# EAGLE design wall_power (EAGLE 6.4)
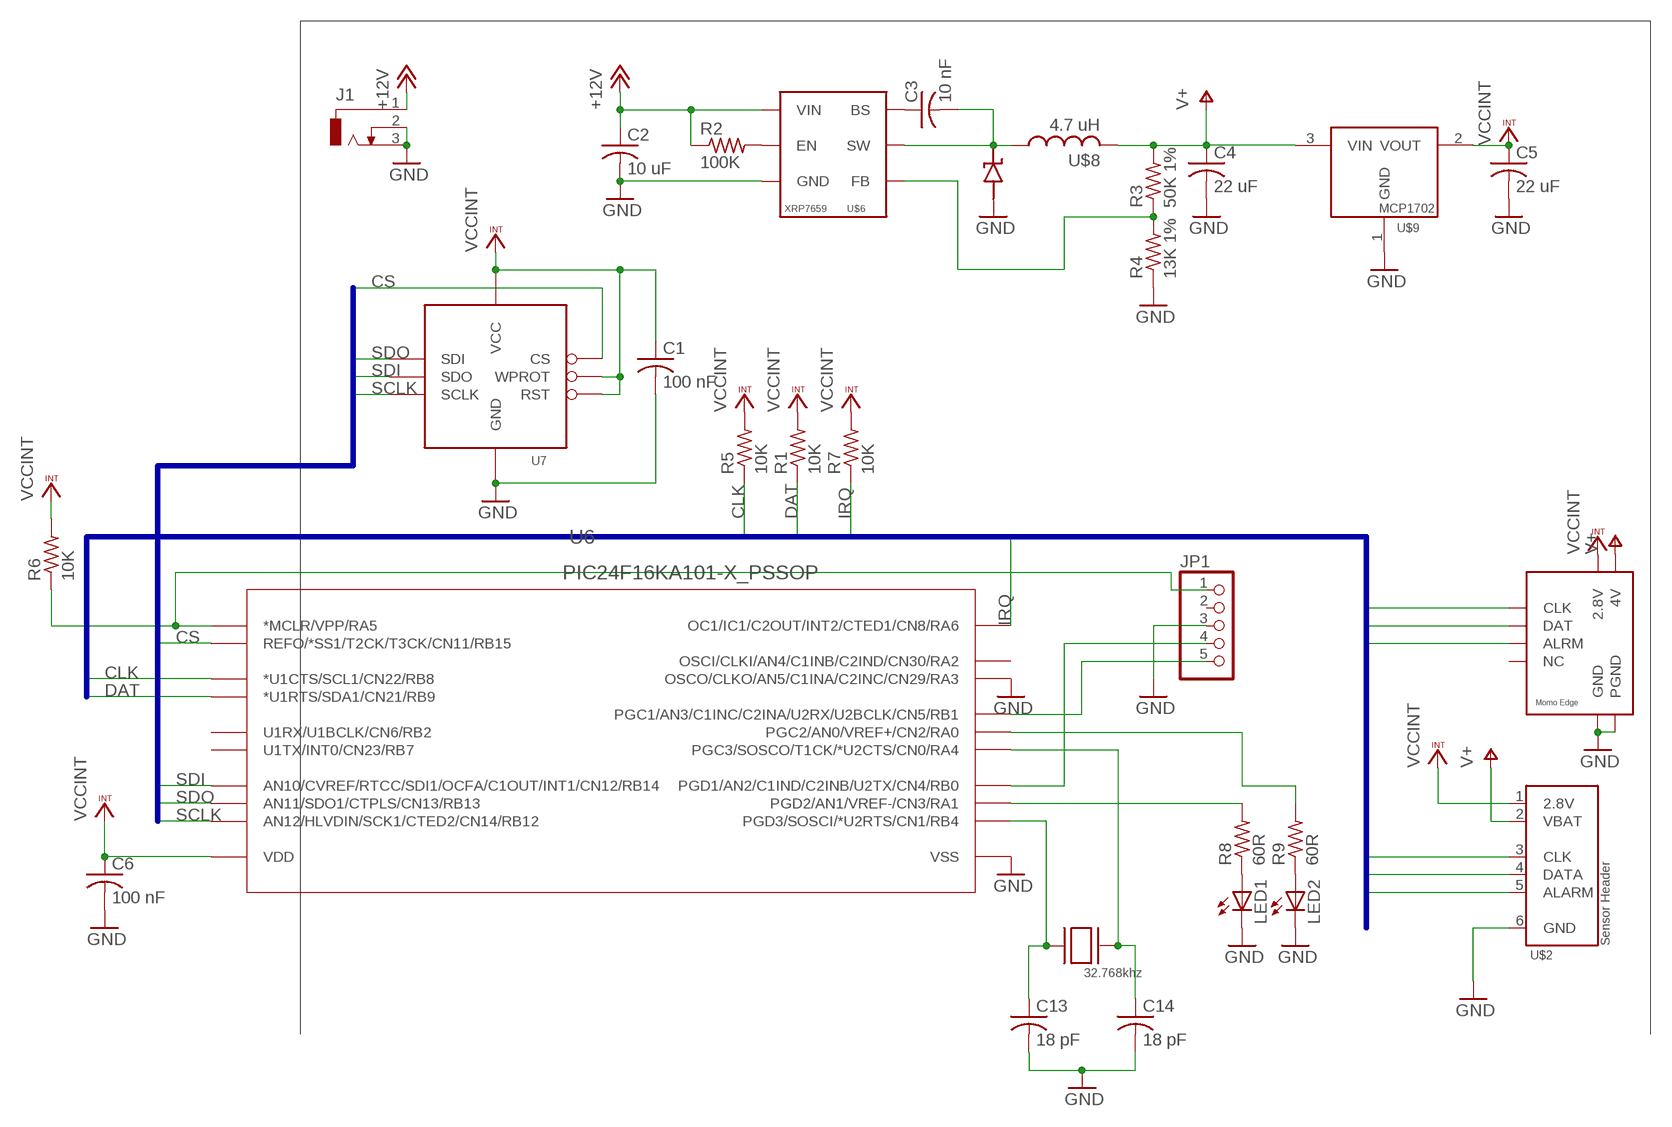
[diagram p0: schematic, sheet 1]

## Parts
C1  100 nF  C-USC0402  [C0402]
C2  10 uF  C-USC0805  [C0805]
C3  10 nF  C-USC0402  [C0402]
C4  22 uF  C-USC1206  [C1206]
C5  22 uF  C-USC0402  [C0402]
C6  100 nF  C-USC0402  [C0402]
C13  18 pF  C-USC0402K  [C0402K]
C14  18 pF  C-USC0402K  [C0402K]
J1  DCJ0303  [DCJ0303]
JP1  PINHD-1X5  [1X05]
LED1  LEDSML0603  [SML0603]
LED2  LEDSML0603  [SML0603]
R1  10K  R-US_R0603  [R0603]
R2  100K  R-US_R0603  [R0603]
R3  50K 1%  R-US_R0603  [R0603]
R4  13K 1%  R-US_R0603  [R0603]
R5  10K  R-US_R0603  [R0603]
R6  10K  R-US_R0603  [R0603]
R7  10K  R-US_R0603  [R0603]
R8  60R  R-US_R0603  [R0603]
R9  60R  R-US_R0603  [R0603]
U6  PIC24F16KA101-X_PSSOP  [SSOP20]
U7  FLASH8MSOP8  [SOP08]
U$1  MOMO-EDGE-8F  [MOMO-EDGE-8F]
U$2  MOMO-SENSOR-HEADER  [2X3-MOLEX-90130@1]
U$6  XRP7659  [SOT23-6L]
U$7  DIODE_SS2P3  [DIODE_SS2P3]
U$8  4.7 uH  NR6028-INDUCTOR  [NR6028-INDUCTOR]
U$9  MCP1702  [SOT23]
XTAL1  32.768khz  SMD-XTAL  [1206]

## Nets
+12V: C2.1 J1.1 R2.1 U$6.5(VIN)
CLK: R5.1 U6.12(*U1CTS/SCL1/CN22/RB8) U$1.CLK U$2.3(CLK)
CS: U6.18(REFO/*SS1/T2CK/T3CK/CN11/RB15) U7.1(CS)
DAT: R1.1 U6.13(*U1RTS/SDA1/CN21/RB9) U$1.DAT U$2.4(DATA)
GND: C1.2 C2.2 C4.2 C5.2 C6.2 C13.2 C14.2 J1.2 J1.3 JP1.3 LED1.C LED2.C R4.1 U6.8(OSCO/CLKO/AN5/C1INA/C2INC/CN29/RA3) U6.19(VSS) U7.4(GND) U$1.GND U$1.PGND U$2.6(GND) U$6.2(GND) U$7.AN U$9.1(GND)
IRQ: R7.1 U6.14(OC1/IC1/C2OUT/INT2/CTED1/CN8/RA6) U$1.ARLM(ALRM) U$2.5(ALARM)
N$1: R9.2 U6.2(PGC2/AN0/VREF+/CN2/RA0)
N$2: C3.2 U$6.6(SW) U$7.CATH U$8.1
N$3: R2.2 U$6.4(EN)
N$4: C3.1 U$6.1(BS)
N$5: LED2.A R9.1
N$6: R3.1 R4.2 U$6.3(FB)
N$7: LED1.A R8.1
N$8: R8.2 U6.3(PGD2/AN1/VREF-/CN3/RA1)
N$9: JP1.4 U6.4(PGD1/AN2/C1IND/C2INB/U2TX/CN4/RB0)
N$10: JP1.5 U6.5(PGC1/AN3/C1INC/C2INA/U2RX/U2BCLK/CN5/RB1)
N$15: JP1.1 R6.1 U6.1(*MCLR/VPP/RA5)
N$24: C14.1 U6.10(PGC3/SOSCO/T1CK/*U2CTS/CN0/RA4) XTAL1.P$2(XTAL2)
N$25: C13.1 U6.9(PGD3/SOSCI/*U2RTS/CN1/RB4) XTAL1.P$1(XTAL1)
SCLK: U6.15(AN12/HLVDIN/SCK1/CTED2/CN14/RB12) U7.6(SCLK)
SDI: U6.17(AN10/CVREF/RTCC/SDI1/OCFA/C1OUT/INT1/CN12/RB14) U7.2(SDO)
SDO: U6.16(AN11/SDO1/CTPLS/CN13/RB13) U7.5(SDI)
V+: C4.1 R3.2 U$1.V4.(4V) U$2.2(VBAT) U$8.2 U$9.3(VIN)
VCCINT: C1.1 C5.1 C6.1 R1.2 R5.2 R6.2 R7.2 U6.20(VDD) U7.3(WPROT) U7.7(RST) U7.8(VCC) U$1.V28(2.8V) U$2.1(2.8V) U$9.2(VOUT)
Unconnected: JP1.2 U6.6(U1RX/U1BCLK/CN6/RB2) U6.7(OSCI/CLKI/AN4/C1INB/C2IND/CN30/RA2) U6.11(U1TX/INT0/CN23/RB7) U$1.NV(NC)

## Buses
PICBUS:CLK,DAT,IRQ
SPI:CS,SDI,SDO,SCLK

## Library data of the parts
C1-C6 C13 C14 = rcl:C-US: CAPACITOR, American symbol
J1 = con-jack:DCJ0303: DC POWER JACK Source: DCJ0303.pdf; OC_FARNELL: unknown; OC_NEWARK: unknown
JP1 = pinhead:PINHD-1X5: PIN HEADER
LED1 LED2 = led:LED: LED OSRAM: - CHIPLED LG R971, LG N971, LY N971, LG Q971, LY Q971, LO R971, LY R971 LH N974, LH R974 LS Q976, LO Q976, LY Q976 LO Q996 - Hyper CHIPLED LW Q18S LB Q993, LB Q99A, LB R99A - SideLED LS A670, LO A670, LY A670, LG A670, LP A670 LB A673, LV A673, LT A673, LW A673 LH A674 LY A675 LS A676, LA A676, LO A676, LY A676, LW A676 LS A679, LY A679, LG A679 - Hyper Micro SIDELED® LS Y876, LA Y876, LO Y876, LY Y876 LT Y87S - SmartLED LW L88C, LW L88S LB L89C, LB L89S, LG L890 LS L89K, LO L89K, LY L89K LS L896, LA L896, LO L896, LY L896 - TOPLED LS T670, LO T670, LY T670, LG T670, LP T670 LSG T670, LSP T670, LSY T670, LOP T670, LYG T670 LG T671, LOG T671, LSG T671 LB T673, LV T673, LT T673, LW T673 LH T674 LS T676, LA T676, LO T676, LY T676, LB T676, LH T676, LSB T676, LW T676 LB T67C, LV T67C, LT T67C, LS T67K, LO T67K, LY T67K, LW E67C LS E67B, LA E67B, LO E67B, LY E67B, LB E67C, LV E67C, LT E67C LW T67C LS T679, LY T679, LG T679 LS T770, LO T770, LY T770, LG T770, LP T770 LB T773, LV T773, LT T773, LW T773 LH T774 LS E675, LA E675, LY E675, LS T675 LS T776, LA T776, LO T776, LY T776, LB T776 LHGB T686 LT T68C, LB T68C - Hyper Mini TOPLED® LB M676 - Mini TOPLED Santana® LG M470 LS M47K, LO M47K, LY M47K Source: http://www.osram.convergy.de LUXEON: - LUMILED® LXK2-PW12-R00, LXK2-PW12-S00, LXK2-PW14-U00, LXK2-PW14-V00 LXK2-PM12-R00, LXK2-PM12-S00, LXK2-PM14-U00 LXK2-PE12-Q00, LXK2-PE12-R00, LXK2-PE12-S00, LXK2-PE14-T00, LXK2-PE14-U00 LXK2-PB12-K00, LXK2-PB12-L00, LXK2-PB12-M00, LXK2-PB14-N00, LXK2-PB14-P00, LXK2-PB14-Q00 LXK2-PR12-L00, LXK2-PR12-M00, LXK2-PR14-Q00, LXK2-PR14-R00 LXK2-PD12-Q00, LXK2-PD12-R00, LXK2-PD12-S00 LXK2-PH12-R00, LXK2-PH12-S00 LXK2-PL12-P00, LXK2-PL12-Q00, LXK2-PL12-R00 Source: www.luxeon.com KINGBRIGHT: KA-3528ASYC Source: www.kingbright.com
R1-R9 = rcl:R-US_: RESISTOR, American symbol
U6 = components:PIC24F16KA101-X_P
U7 = components:FLASH8M
U$1 = components:MOMO-EDGE-8F
U$2 = components:MOMO-SENSOR-HEADER
U$6 = components:XRP7659
U$7 = components:DIODE_SS2P3
U$8 = components:NR6028-INDUCTOR
U$9 = components:MCP1702
XTAL1 = components:SMD-XTAL

## Net classes
0 default: width 0.152 mm, drill 0.305 mm, clearance 0.152 mm

## Board
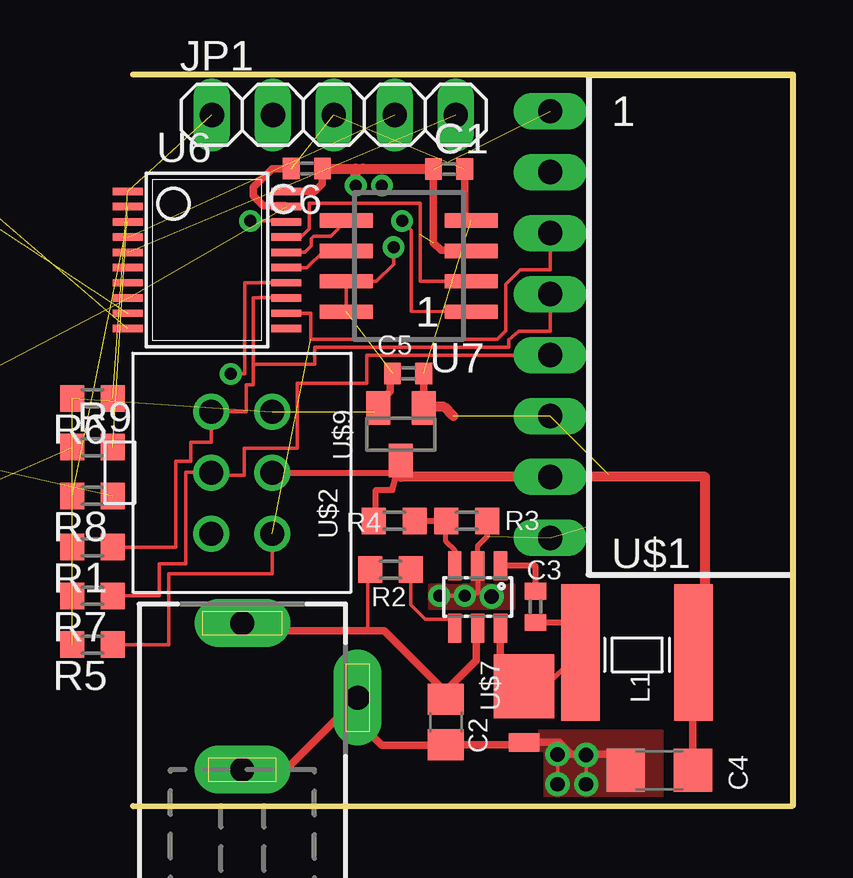
[diagram p1: board, top side]
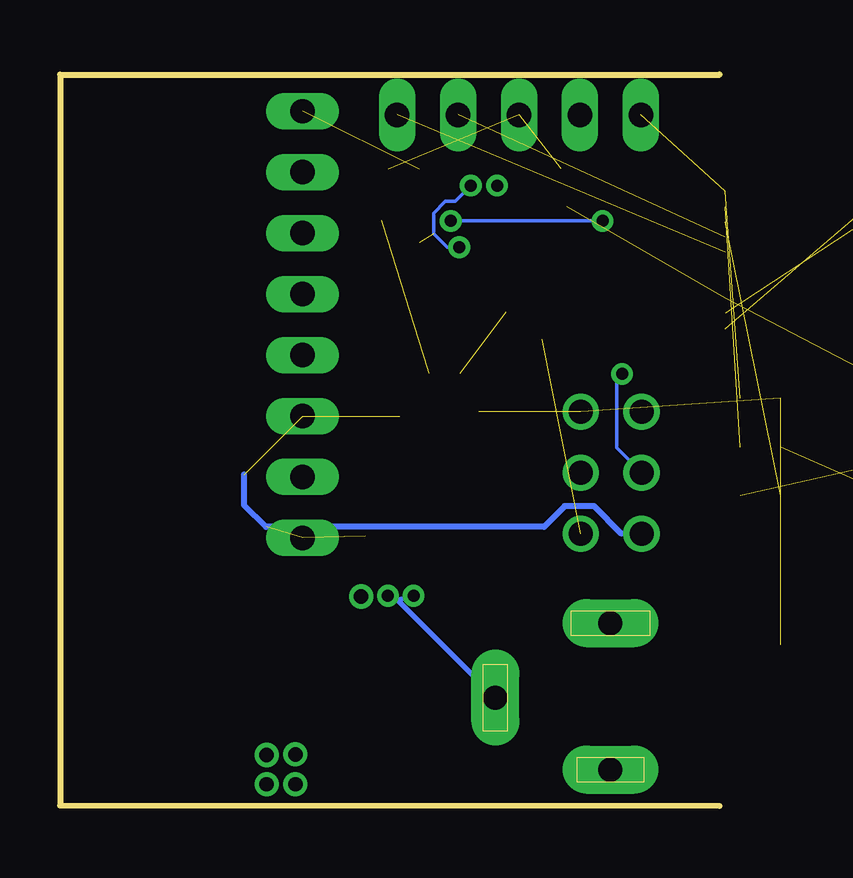
[diagram p2: board, bottom side, seen from below]

Size 27.48 x 30.48 mm. Coordinates in mm from the lower left corner, seen from the top.
Outline: 0,0 27.48,0.03 27.48,30.48 0,30.48
Copper layers (1*16): Top 0.035mm / dielectric 1.5mm / Bottom 0.035mm
Design rules "default *": minimum track width 6mil, minimum drill 19mil, track to track 6mil, track to pad 6mil, pad to pad 6mil, via to via 6mil, smd to smd 6mil, copper to edge 10mil, drill to drill 8mil, minimum pad ring 10mil, minimum via ring 8mil, stop-mask expansion 4mil, vias tented up to drill 0mil, thermal gap 10mil

### Footprints (pad centres in the part's own frame; a part is rotated, then mirrored left to right if it is on the bottom)
C0402 = smd 0.7 x 0.9: 1 -0.65,0; 2 0.65,0
C0805 = smd 1.3 x 1.5: 1 -0.95,0; 2 0.95,0
C1206 = smd 1.6 x 1.8: 1 -1.4,0; 2 1.4,0
C0402K = smd 0.925 x 0.74: 1 -0.6,0; 2 0.6,0
DCJ0303 = drill 1 pad 2 long: 1 0,3.1; 2 4.8,0; 3 0,-3
1X05 = drill 1.016 long: 1 -5.08,0; 2 -2.54,0; 3 0,0; 4 2.54,0; 5 5.08,0
SML0603 = smd 0.8 x 0.8: A 0.75,0; C -0.75,0
R0603 = smd 1 x 1.1: 1 -0.85,0; 2 0.85,0
SSOP20 = smd 0.305 x 1.245: 1 -2.857,-3.302; 2 -2.222,-3.302; 3 -1.587,-3.302; 4 -0.952,-3.302; 5 -0.317,-3.302; 6 0.318,-3.302; 7 0.953,-3.302; 8 1.588,-3.302; 9 2.223,-3.302; 10 2.858,-3.302; 11 2.858,3.302; 12 2.223,3.302; 13 1.588,3.302; 14 0.953,3.302; 15 0.318,3.302; 16 -0.317,3.302; 17 -0.952,3.302; 18 -1.587,3.302; 19 -2.222,3.302; 20 -2.857,3.302
SOP08 = smd 0.6 x 2.2: 1 -1.905,-2.6; 2 -0.635,-2.6; 3 0.635,-2.6; 4 1.905,-2.6; 5 1.905,2.6; 6 0.635,2.6; 7 -0.635,2.6; 8 -1.905,2.6
MOMO-EDGE-8F = drill 1.016 long: ARLM 0,0; CLK 0,5.08; DAT 0,2.54; GND 0,-2.54; NV 0,7.62; PGND 0,-7.62; V4. 0,-5.08; V28 0,10.16
2X3-MOLEX-90130@1 = drill 1: 1 -2.54,2.54; 2 0,2.54; 3 2.54,2.54; 4 -2.54,0; 5 0,0; 6 2.54,0
SOT23-6L = smd 0.55 x 1.2: 1 -0.95,-1.3; 2 0,-1.3; 3 0.95,-1.3; 4 0.95,1.3; 5 0,1.3; 6 -0.95,1.3
DIODE_SS2P3 = smd 0.762 x 1.27: AN 2.349,0 | smd 2.667 x 2.54: CATH 0,0
NR6028-INDUCTOR = smd 1.6 x 5.7: 1 0,0; 2 4.7,0
SOT23 = smd 1 x 1.4: 1 -0.95,-1.1; 2 0.95,-1.1; 3 0,1.1
1206 = smd 1.1 x 1.9: P$1 0,0; P$2 2.5,0

### Placement (x,y rotation side)
C1  13.16,26.54 0 top
C2  13.03,3.51 270 top
C3  16.76,8.31 270 top
C4  21.92,1.5 180 top
C5  11.46,18.03 0 top
C6  7.24,26.57 180 top
C13  -17.45,25.07 0 top  (outside the outline)
C14  -19.33,26.59 0 top  (outside the outline)
J1  4.55,4.52 0 top
JP1  8.36,28.8 0 top
LED1  -11.13,15.09 0 top  (outside the outline)
LED2  -11.18,11.51 0 top  (outside the outline)
R1  -1.7,10.79 180 top
R2  10.72,9.86 0 top
R3  10.87,11.89 180 top
R4  13.89,11.89 180 top
R5  -1.7,6.73 180 top
R6  -1.7,16.99 180 top
R7  -1.7,8.76 180 top
R8  -1.7,12.93 180 top
R9  -1.7,14.96 0 top
U6  3.07,22.76 270 top
U7  11.48,22.5 90 top
U$1  17.37,18.8 0 top
U$2  3.25,13.89 270 top
U$6  14.35,8.71 180 top
U$7  16.28,5 270 top
U$8  18.64,6.4 0 top
U$9  11.15,15.49 180 top
XTAL1  -14.05,29.59 0 top  (outside the outline)

### Tracks (layer width: path | path; a pad name or v marks a point on that pad's centre or on a via)
+12V
  Top 0.152: R2.1 9.78,9.86 9.78,7.32
  Top 0.305: C2.1 13.03,4.75 | 13.03,4.75 10.46,7.32 9.78,7.32 4.85,7.32 J1.1 | 13.03,4.75 13.03,4.8 14.3,6.07 14.3,7.36 U$6.5
  cutout Top (no thermals): 14.58,7.92 14.58,3.89 11.51,3.89 11.51,5.16 9.93,6.73 8.61,6.73 7.8,5.92 2.64,5.92 1.93,6.63 1.93,8.51 2.64,9.22 9.04,9.22 9.04,8.89 10.62,8.89 12.09,7.42 12.85,7.42 12.85,6.55 14.15,6.55 14.15,7.92
CLK  (1 unrouted)
  Top 0.152: R5.1 1.47,6.73 1.47,9.68 5.79,9.68 U$2.3 | U6.12 7.39,20.54 7.39,19.46 15.16,19.46 15.52,19.81 15.52,21.74 16.13,22.35 17.37,22.35 U$1.CLK
CS  (via drill 0.5)
  Top 0.152: U7.1 11.58,20.63 11.58,24 v11.2,24.38 | v4.88,24.38 6.38,24.38 U6.18
  Bottom 0.152: v11.2,24.38 v4.88,24.38
DAT
  Top 0.152: 6.38,21.16 U6.13 5,21.18 5,18.42 | R1.1 1.78,10.8 1.78,14.38 2.39,14.38 2.39,15.16 3.25,15.16 U$2.4 4.7,16.43 4.7,17.55 5,17.55 5,18.42 | 5,18.42 7.57,18.42 7.57,19.13 15.65,19.13 15.65,19.43 16.05,19.79 17.37,19.79 U$1.DAT
GND  (via drill 0.5, 0.6)  (12 unrouted)
  Top 0.152: v18.87,0.91 v18.87,2.13 18.52,1.93 18.29,2.16 | v17.68,0.91 v17.68,2.16 17.65,1.96 18.05,2.35
  Top 0.203: R4.1 14.76,11.87 14.76,11.25 14.35,10.85 U$6.2 14.35,8.89 v13.82,8.76 13.44,8.74 v12.75,8.76
  Top 0.305: J1.3 6.35,1.52 J1.2 9.35,3.56 10.36,2.54 13.01,2.54 C2.2 16.18,2.56 U$7.AN 17.74,2.65 18.05,2.35 18.24,2.16 18.29,2.16 20.42,2.16 C4.2 | U$9.1 C5.2 | C6.2 5.79,26.57 5,25.78 5,25.43 5.41,25.02 6.34,25.02 U6.19 | C1.2 13.81,24.68 U7.4
  Top 0.406: 13.33,16.26 12.95,16.64 12.14,16.64 U$9.1
  Bottom 0.203: v12.75,8.76 13.41,8.59 J1.2
  Bottom 0.254: U$2.6 4.09,11.35 5.23,12.5 6.45,12.5 7.31,11.63 18.9,11.63 19.81,12.55 19.81,13.82
  other vias: 14.94,8.74
  cutout Top (no thermals): 16.79,3.12 16.79,0.08 1.6,0.2 1.6,5.56 8.05,5.56 8.86,6.38 9.73,6.38 11.15,4.95 11.15,3.12
  pour Top (no thermals): 14.12,10.57 14.12,9.19 12.34,9.19 12.34,8.25 15.85,8.25 15.85,9.19 14.58,9.19 14.58,10.57
  cutout Bottom (no thermals): 15.85,9.58 -0.03,6.65 -0.05,-0.05 15.85,-0.05
  pour Top (no thermals): 16.81,3.12 22.02,3.12 22.02,0.18 17.17,0.2 17.17,2.34 16.81,2.34
  cutout Bottom (isolate 0.254, no thermals): -0.03,7.14 16.23,10.06 16.23,-0.05 27.51,-0.05 27.51,30.53 -0.05,30.53
IRQ  (via drill 0.5)
  Top 0.152: U$1.ARLM 9.73,18.8 9.73,17.63 6.83,17.63 6.83,14.91 4.62,14.91 4.62,13.79 3.25,13.79 U$2.5 | 3.25,13.82 U$2.5 | R7.1 1.09,8.76 1.09,10.11 2.18,10.11 2.18,13.92 3.25,13.92 U$2.5 | U6.14 4.65,21.81 4.65,18.01 v4.06,18.01
  Bottom 0.152: v4.06,18.01 4.29,18.01 4.29,14.94 U$2.5
N$1  (1 unrouted)
N$2
  Top 0.152: 18.2,8.95 18.21,8.94 18.21,6.91 U$8.1
  Top 0.203: U$7.CATH 17.12,5 U$8.1
  Top 0.254: C3.2 18.74,7.66 18.74,7.75 18.64,7.75 U$8.1
  Top 0.305: U$6.6 15.3,5.98 U$7.CATH
  cutout Top (no thermals): 15.06,7.95 17.63,8 17.63,9.47 19.71,9.47 19.76,3.58 15.06,3.58
N$3
  Top 0.152: R2.2 11.57,8.4 12.17,7.8 13.4,7.8 U$6.4
N$4
  Top 0.254: C3.1 16.76,10.01 U$6.1
N$5  (1 unrouted)
N$6
  Top 0.203: U$6.3 13.4,10.65 13.03,11.02 13.03,11.87 R4.2
  Top 0.254: R3.1 R4.2
N$7  (1 unrouted)
N$8  (1 unrouted)
N$9  (1 unrouted)
N$10  (1 unrouted)
N$15  (2 unrouted)
N$24  (2 unrouted)
N$25  (2 unrouted)
SCLK
  Top 0.152: U7.6 7.95,23.14 7.24,22.43 6.39,22.43 U6.15
SDI
  Top 0.152: U6.17 6.39,23.72 7.01,23.72 7.34,24.05 7.34,25.12 11.96,25.12 11.96,21.87 U7.2
SDO
  Top 0.152: U6.16 7.15,23.08 7.42,23.34 7.42,23.65 7.52,23.75 8.22,23.75 U7.5
V+
  Top 0.254: R3.2 10.11,11.89 10.11,13.18 10.79,13.18 11.01,13.91 | 11.01,13.91 U$9.3 | 23.32,6.5 23.49,6.5 | U$2.2 10.99,13.89 11.01,13.91
  Top 0.305: C4.1 23.32,6.5 U$8.2 23.37,6.5
  Top 0.406: 23.49,6.5 23.82,6.5 23.82,13.72 U$1.V4. 11.15,13.72 U$9.3
  cutout Top (no thermals): 22.58,10.39 22.58,0.08 27.51,0.08 27.53,15.09 9.12,15.09 9.12,12.95 17.32,12.93 17.3,12.73 22.94,12.73 22.94,10.39
VCCINT  (via drill 0.5)  (8 unrouted)
  Top 0.152: U7.8 U7.7 10.13,21.87 10.85,22.58 v10.85,23.29
  Top 0.254: 10.04,16.43 U$9.2
  Top 0.305: U$9.2 10.2,16.78 10.72,17.3 10.72,17.95 C5.1 | U6.20 7.56,25.62 7.87,25.93 7.87,26.55 C6.1 | C1.1 12.51,23.48 12.83,23.17 14.06,23.17 U7.3
  Top 0.406: C6.1 9.27,26.57 | C1.1 12.48,26.57 9.58,26.57 9.27,26.57 | v9.27,25.86 9.27,26.57
  Bottom 0.152: v10.85,23.29 11.35,23.29 11.91,23.85 11.91,24.71 11.43,25.2 11.02,25.2 v10.36,25.86

### Text on the board
tPlace: L1